# Altium schematic sheet PowerBoard_Schematic.SchDoc
size A; SheetNumber: 4; SheetTotal: 4
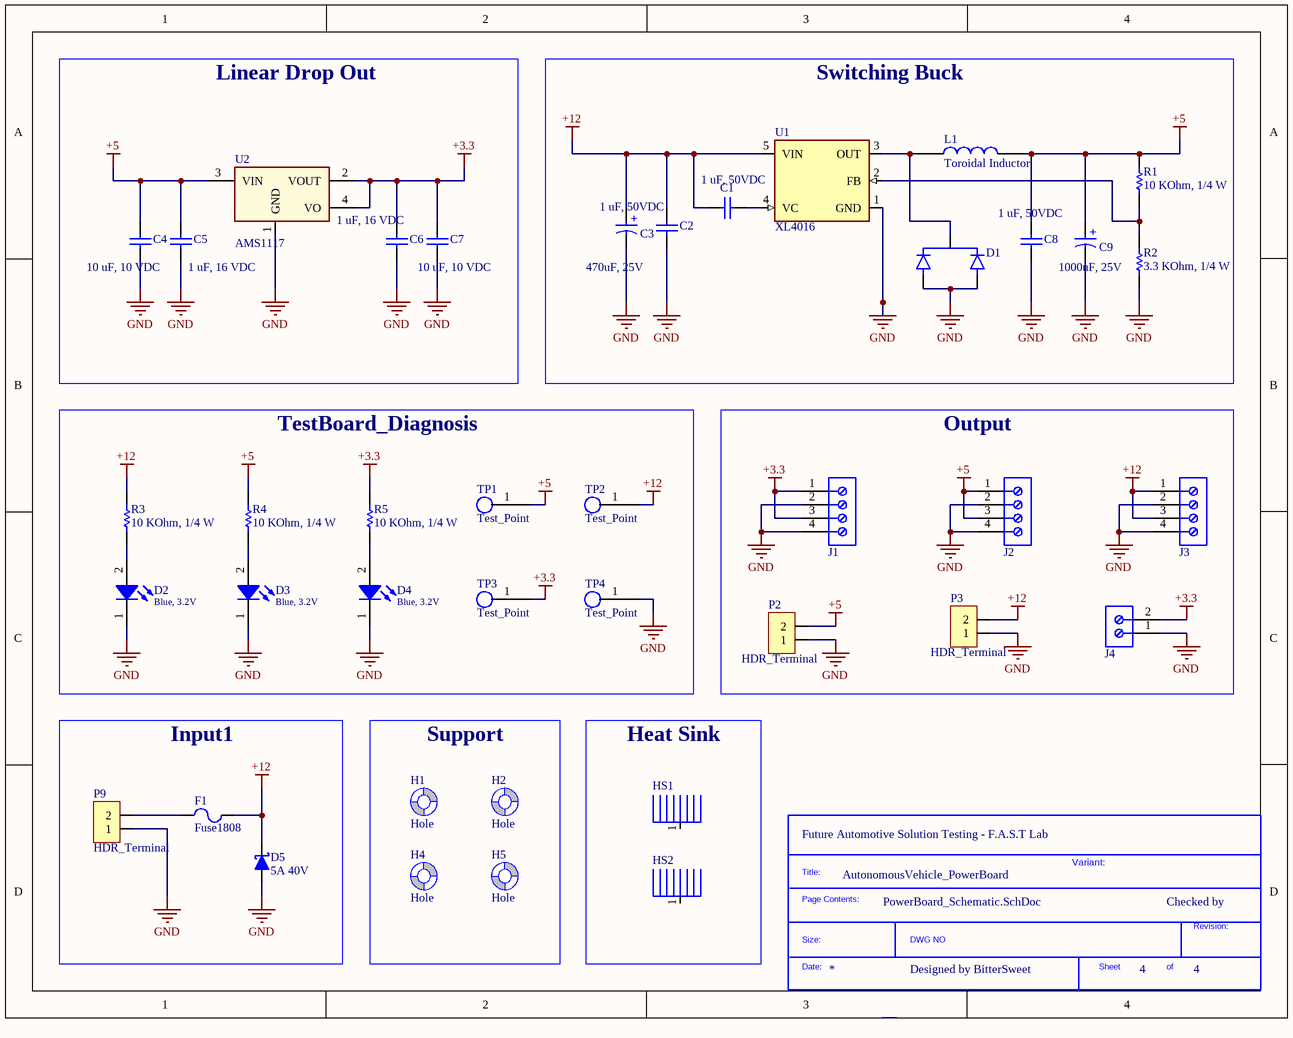
[diagram p0: PowerBoard_Schematic.SchDoc]

## Parts
*?  SDTitleBlock  (value not drawn)  (graphical)
C1  1 uF, 50VDC  [CAP_RADIAL_2.54]
C2  1 uF, 50VDC  [CAP_RADIAL_2.54]
C3  470uF, 25V  [WCAP-ASLI_D10H10.5]
C4  10 uF, 10 VDC  [CAP_0603]
C5  1 uF, 16 VDC  [CAP_0603]
C6  1 uF, 16 VDC  [CAP_0603]
C7  10 uF, 10 VDC  [CAP_0603]
C8  1 uF, 50VDC  [CAP_RADIAL_2.54]
C9  1000uF, 25V  [WCAP-ASLI_D12.5H14]
D1  Diode_Schottky  [TO-220AB]  (value not drawn)
D2  Blue, 3.2V  [WL-SMCW_0603_H=0.7mm]
D3  Blue, 3.2V  [WL-SMCW_0603_H=0.7mm]
D4  Blue, 3.2V  [WL-SMCW_0603_H=0.7mm]
D5  5A 40V  [DO-214AB, SMC]
F1  Fuse1808  [FuseHolder1808]
H1  Hole  [Hole_3.2mm]
H2  Hole  [Hole_3.2mm]
H4  Hole  [Hole_3.2mm]
H5  Hole  [Hole_3.2mm]
HS1  HeatSink_1Hole  [HEATSINK_TO220_SMALL]  (value not drawn)
HS2  HeatSink_1Hole  [HEATSINK_TO220_SMALL]  (value not drawn)
J1  6A, 150V  [691210910004]  (value not drawn)
J2  6A, 150V  [691210910004]  (value not drawn)
J3  6A, 150V  [691210910004]  (value not drawn)
J4  6A, 150V  [691210910002]  (value not drawn)
L1  Toroidal Inductor  [Toroidal Inductor]
P2  HDR_Terminal  [KF-5.08-2-R]
P3  HDR_Terminal  [KF-5.08-2-R]
P9  HDR_Terminal  [KF-5.08-2-R]
R1  10 KOhm, 1/4 W  [resistor_0603]
R2  3.3 KOhm, 1/4 W  [resistor_0603]
R3  10 KOhm, 1/4 W  [resistor_0603]
R4  10 KOhm, 1/4 W  [resistor_0603]
R5  10 KOhm, 1/4 W  [resistor_0603]
TP1  Test_Point  [TP_1_5mm_SMD]
TP2  Test_Point  [TP_1_5mm_SMD]
TP3  Test_Point  [TP_1_5mm_SMD]
TP4  Test_Point  [TP_1_5mm_SMD]
U1  XL4016  [XL4016_TO-220-5]
U2  AMS1117  [AMS1117]

## Blocks framed on the sheet
Linear Drop Out: C4-C7 U2
Switching Buck: C1-C3 C8 C9 D1 L1 R1 R2 U1
TestBoard_Diagnosis: D2-D4 R3-R5 TP1-TP4
Output: J1-J4 P2 P3
Input1: D5 F1 P9
Support: H1 H2 H4 H5
Heat Sink: HS1 HS2

## Nets
+3.3: C6.2 C7.1 J1.1 J1.3 J4.2 R5.1 TP3.1 U2.2(VOUT) U2.4(VO)
+5: C4.1 C5.2 C8.2 C9.1(P) J2.1 J2.3 L1.2 P2.2 R1.1 R4.1 TP1.1 U2.3(VIN)
+12: C1.1 C2.1 C3.1(P) D5.2(K) F1.2 J3.1 J3.3 P3.2 R3.1 TP2.1 U1.5(VIN)
GND: C2.2 C3.2(N) C4.2 C5.1 C6.1 C7.2 C8.1 C9.2(N) D1.1(A1) D1.3(A2) D2.1(K) D3.1(K) D4.1(K) D5.1(A) J1.2 J1.4 J2.2 J2.4 J3.2 J3.4 J4.1 P2.1 P3.1 P9.1 R2.1 TP4.1 U1.1(GND) U2.1(GND)
NetC1_2: C1.2 U1.4(VC)
NetD1_2: D1.2(C) L1.1 U1.3(OUT)
NetD2_2: D2.2(A) R3.2
NetD3_2: D3.2(A) R4.2
NetD4_2: D4.2(A) R5.2
NetF1_1: F1.1 P9.2
NetR1_2: R1.2 R2.2 U1.2(FB)

Not connected (* = marked no-connect by the designer): H1 1(Screw); H2 1(Screw); H4 1(Screw); H5 1(Screw); HS1 1; HS2 1

## Notes on the sheet
- (near *?) Future Automotive Solution Testing - F.A.S.T Lab
- AutonomousVehicle_PowerBoard
- Variant:
- Checked by
- Designed by BitterSweet
- (in symbol 865080457015) +
- (in symbol 865080462016) +
- (in symbol SDTitleBlock) Title:; Page Contents:; Revision:; Size:; DWG NO; Date:; Sheet; of

## Library data of the parts
C1 C2 C8 = Capacitor: JLCPCB Part: C108343; ComponentLink1Description: JLCPCB Link; ComponentLink1URL: https://jlcpcb.com/partdetail/109562-0603F105M500NT/C108343
C3 = 865080457015: V-Chip, D10 x H10.5mm, 470uF, 25V; Manufacturer: Wurth Elektronik; Capacitance Tolerance: +/-20%; Dissipation Factor: 14%; Endurance: 2000h; Leakage Current: 117.5uA; Ripple Current: 650mA; Category: Aluminum Electrolytic Capacitors; ComponentLink2Description: Datasheet Link; ComponentLink2URL: https://www.we-online.com/redexpert/spec/865080457015?ad; Mount: Surface Mount; Operating Temperature Max: 105°C; Operating Temperature Min: -55°C; Packaging: Tape and Reel; Height: 10.5mm; Diameter: 10mm; Capacitance: 470uF; Rated Voltage (DC): 25V; Supplier 1 Name: Mouser; Supplier 1 SN: 710-865080457015; Supplier 3 URL: https://www.thegioiic.com/tu-nhom-smd-470uf-25v-10x10-5mm; Supplier 3 Name: thegioiic; Supplier 1 URL: https://www.mouser.com/ProductDetail/Wurth-Elektronik/865080457015?qs=0KOYDY2FL2%252BEKTJa1jxjAQ%3D%3D; Manufacturer Part Number: N/A; Supplier 2 Name: Digi-Key; Supplier 2 SN: N/A; Supplier 2 URL: N/A; Supplier 3 SN: N/A; Value: 470uF, 25V; JLCPCB Part: *; ComponentLink3Description: JLCPCB Link; ComponentLink3URL: *
C4 C7 = 0106031061010: CAP, size 0603, 10 uF, 10 VDC; Manufacture Name: Samsung Electro-Mechanics; Manufacture SN: CL10A106KP8NNWC; Capacitance: 10 uF; Tolerance: +/-10%; Voltage Rating DC: 10 VDC; ComponentLink2Description: Datasheet; ComponentLink2URL: https://www.mouser.vn/datasheet/2/585/MLCC-1837944.pdf; Operating Temperature: -55 to +125degC; Packaging: Tape and Reel; Mounting Technology: SMT; Size: 0603; Supplier 1 Name: Mouser; Supplier 1 SN: 187-CL10A106KP8NNWC; Supplier 1 URL: https://www.mouser.vn/ProductDetail/Samsung-Electro-Mechanics/CL10A106KP8NNWC?qs=xZ%2FP%252Ba9zWqZx8LSX23YqWA%3D%3D&utm_source=mouser-refine-download&utm_medium=file&utm_campaign=CL10A106KP8NNWC&utm_content=Samsung-Electro-Mechanics; Supplier 2 Name: Digi-Key; Supplier 2 SN: 1276-CL10A106KP8NNWCTR-ND; Supplier 2 URL: https://www.digikey.com/en/products/detail/samsung-electro-mechanics/cl10a106kp8nnwc/16572907; Supplier 3 Name: thegioiic; Supplier 3 SN: N/A; Supplier 3 URL: https://www.thegioiic.com/tu-gom-0603-10uf-25v; Value: 10 uF, 10 VDC; JLCPCB Part: C91150; ComponentLink3Description: JLCPCB Link; ComponentLink3URL: https://jlcpcb.com/partdetail/92339-0603X106M100NT/C91150
C5 C6 = 0106031051016: CAP, size 0603, 1 uF, 16 VDC; Manufacture Name: Samsung Electro-Mechanics; Manufacture SN: CL10B105KO8NNWC; Capacitance: 1 uF; Tolerance: +/-10%; Voltage Rating DC: 16 VDC; ComponentLink2Description: Datasheet; ComponentLink2URL: https://www.mouser.vn/datasheet/2/585/Samsung_MLCC_1837944-1929650.pdf; Operating Temperature: -55 to +125degC; Packaging: Tape and Reel; Mounting Technology: SMT; Size: 0603; Supplier 1 Name: Mouser; Supplier 1 SN: 187-CL10B105KO8NNWC; Supplier 1 URL: https://www.mouser.vn/ProductDetail/Samsung-Electro-Mechanics/CL10B105KO8NNWC?qs=81r%252BiQLm7BT%252BXtc72qn1ug%3D%3D&utm_source=mouser-refine-download&utm_medium=file&utm_campaign=CL10B105KO8NNWC&utm_content=Samsung-Electro-Mechanics; Supplier 2 Name: Digi-Key; Supplier 2 SN: 1276-CL10B105KO8NNWCTR-ND; Supplier 2 URL: https://www.digikey.com/en/products/detail/samsung-electro-mechanics/cl10b105ko8nnwc/16572783; Supplier 3 Name: thegioiic; Supplier 3 SN: N/A; Supplier 3 URL: https://www.thegioiic.com/tu-gom-0603-1uf-16v; Value: 1 uF, 16 VDC; JLCPCB Part: C106248; ComponentLink3Description: JLCPCB Link; ComponentLink3URL: https://jlcpcb.com/partdetail/Yageo-CC0603KRX7R7BB105/C106248
C9 = 865080462016: V-Chip, D12.5 x H14mm, 1000uF, 25V; Manufacturer: Wurth Elektronik; Capacitance Tolerance: +/-20%; Dissipation Factor: 14%; Endurance: 5000h; Leakage Current: 250uA; Ripple Current: 1100mA; Category: Aluminum Electrolytic Capacitors; ComponentLink2Description: Datasheet Link; ComponentLink2URL: https://www.we-online.com/redexpert/spec/865080462016?ad; Mount: Surface Mount; Operating Temperature Max: 105°C; Operating Temperature Min: -55°C; Packaging: Tape and Reel; Height: 14mm; Diameter: 12.5mm; Capacitance: 1000uF; Rated Voltage (DC): 25V; Supplier 1 Name: Mouser; Supplier 1 SN: 710-865080462016; Supplier 1 URL: https://www.mouser.com/ProductDetail/Wurth-Elektronik/865080462016?qs=0KOYDY2FL2%252BphFKARPaJJA%3D%3D; Supplier 3 Name: thegioiic; Supplier 3 URL: https://www.thegioiic.com/tu-nhom-smd-1000uf-25v-12-5x13-5mm; Manufacturer Part Number: N/A; Supplier 2 Name: Digi-Key; Supplier 2 SN: N/A; Supplier 2 URL: N/A; Value: 1000uF, 25V; JLCPCB Part: *
D1 = Dual_Diode_Schottky: MBR20100CT Diode Schottky 100V 10A TO-220; JLCPCB Part: *
D2-D4 = 160603BlueClear: WL-SMCW SMT Mono-color Chip LED Waterclear, size 0603, Blue, 3.2V, 140deg; Type: Clear; Color: Blue; Size: 0603; ComponentLink1Description: Datasheet link; ComponentLink1URL: N/A; ComponentLink2Description: Supplier 1 URL; ComponentLink2URL: https://www.mouser.vn/ProductDetail/Wurth-Elektronik/150060BS75003?qs=Li%252BoUPsLEnu8LvIbM48DKA%3D%3D; ComponentLink3Description: Supplier 2 URL; ComponentLink3URL: https://www.digikey.com/en/products/detail/liteon/LTST-C191TBKT/388530; ComponentLink4Description: Supplier 3 URL; ComponentLink4URL: https://www.thegioiic.com/led-xanh-duong-0603-dan-smd-trong-suot; Supplier 1 Name: Mouser; Supplier 1 SN: 710-150060GS75000; Supplier 1 URL: https://www.mouser.vn/ProductDetail/Wurth-Elektronik/150060BS75003?qs=Li%252BoUPsLEnu8LvIbM48DKA%3D%3D; Supplier 2 Name: Digi-Key; Supplier 2 SN: 160-1647-2-ND; Supplier 2 URL: https://www.digikey.com/en/products/detail/liteon/LTST-C191TBKT/388530; Supplier 3 Name: ICDayRoi; Supplier 3 SN: N/A; Supplier 3 URL: https://www.thegioiic.com/led-xanh-duong-0603-dan-smd-trong-suot; Value: Blue, 3.2V; JLCPCB Part: C99290; ComponentLink5Description: JLCPCB Link; ComponentLink5URL: https://jlcpcb.com/partdetail/LiteOn-LTSTC191TBKT/C99290
D5 = Diode_Schottky: SS54 SMC Diode Schottky 5A 40V; JLCPCB Part: C2904822; ComponentLink1Description: JLCPCB Link; ComponentLink1URL: https://jlcpcb.com/partdetail/YONGYUTAI-SS54/C2904822
F1 = Fuse1808: Fuse 1808 Holder SMD fast blow L9.73xW5.03xH3.81; JLCPCB Part: C206917; ComponentLink1Description: JLCPCB Link; ComponentLink1URL: https://jlcpcb.com/partdetail/Littelfuse-0154005DRT/C206917; ComponentLink2Description: Thegioiic Link; ComponentLink2URL: https://www.thegioiic.com/de-cau-chi-1808-dan-smd; ComponentLink3Description: Fuse Thegioiic Link; ComponentLink3URL: https://www.thegioiic.com/cau-chi-cat-nhanh-smd-1808-20a-250v
J1-J3 = 691210910004: WR-TBL Series 2109 Horizontal Entry, THT, pitch 2.54mm, 4p; Manufacturer: Wurth Elektronik; Modularity: No; ComponentLink1Description: Datasheet Link; ComponentLink1URL: https://www.we-online.com/redexpert/spec/691210910004?ad; ComponentLink2Description: Supplier 1 URL; ComponentLink2URL: N/A; Manufacturer Part Number: 691210910004; Category: Terminal Blocks; Match Code: WR-TBL; Mount: Through Hole; Operating Temperature Max: 105°C; Operating Temperature Min: -40°C; Packaging: Box; Application: Rising Cage Clamp; Number of Pins: 4; Number of Rows: 1; Orientation: Horizontal; Pitch: 2.54mm; Rated Current: 6A; Working Voltage: 150V; ComponentLink3Description: Supplier 2 URL; ComponentLink3URL: N/A; ComponentLink4Description: Supplier 3 URL; ComponentLink4URL: https://www.thegioiic.com/kf120-4-v-domino-4-chan-thang-2-54mm-150v-6a-han-pcb; Supplier 1 Name: Mouser; Supplier 1 SN: N/A; Supplier 1 URL: N/A; Supplier 2 Name: Digi-Key; Supplier 2 SN: N/A; Supplier 2 URL: N/A; Supplier 3 Name: thegioiic; Supplier 3 SN: N/A; Supplier 3 URL: https://www.thegioiic.com/kf120-4-v-domino-4-chan-thang-2-54mm-150v-6a-han-pcb; Value: 6A, 150V
J4 = 691210910002: WR-TBL Series 2109 Horizontal Entry, THT, pitch 2.54mm, 2p; Manufacturer: Wurth Elektronik; Modularity: No; ComponentLink1Description: Datasheet Link; ComponentLink1URL: https://www.we-online.com/redexpert/spec/691210910002?ad; ComponentLink2Description: Supplier 1 URL; ComponentLink2URL: N/A; Manufacturer Part Number: 691210910002; Category: Terminal Blocks; Match Code: WR-TBL; Mount: Through Hole; Operating Temperature Max: 105°C; Operating Temperature Min: -40°C; Packaging: Box; Application: Rising Cage Clamp; Number of Pins: 2; Number of Rows: 1; Orientation: Horizontal; Pitch: 2.54mm; Rated Current: 6A; Working Voltage: 150V; ComponentLink3Description: Supplier 2 URL; ComponentLink3URL: N/A; ComponentLink4Description: Supplier 3 URL; ComponentLink4URL: https://www.thegioiic.com/kf128-2-v-domino-2-chan-thang-2-54mm-150v-6a-han-pcb; Supplier 1 Name: Mouser; Supplier 1 SN: N/A; Supplier 1 URL: N/A; Supplier 2 Name: Digi-Key; Supplier 2 SN: N/A; Supplier 2 URL: N/A; Supplier 3 Name: thegioiic; Supplier 3 SN: N/A; Supplier 3 URL: https://www.thegioiic.com/kf128-2-v-domino-2-chan-thang-2-54mm-150v-6a-han-pcb; Value: 6A, 150V
L1 = Toroidal Inductor: Dipole Toroidal Inductor, 47uH, 8A
P2 P3 P9 = HDR_Terminal: HDR_Terminal 2 pin; Supplier: ThegioiIC; ComponentLink1Description: URL; ComponentLink1URL: https://www.thegioiic.com/kf128-2-v-domino-2-chan-thang-3-5mm-300v-10a-han-pcb
R1 R3-R5 = 0006031031: RES, size 0603, 10 KOhm, 1/4 W; Manufacture  Name: OEM; Resistance: 10 KOhm; Rated Power: 1/4 W; Resistance Tolerance: +/-1%; Size: 0603; Mounting Technology: SMT; Supplier 1 Name: Mouser; Supplier 1 SN: 755-ESR03EZPF1002; Supplier 2 Name: Digi-Key; Supplier 2 SN: RHM10KADTR-ND RHM10KADCT-ND RHM10KADDKR-ND; Supplier 1 URL: https://www.mouser.vn/ProductDetail/ROHM-Semiconductor/ESR03EZPF1002?qs=sGAEpiMZZMvdGkrng054t67Efho1F8r6CDeAsqwFse8%3D; Supplier 3 Name: thegioiic; Supplier 3 SN: N/A; Supplier 3 URL: N/A; Manufacture  SN: OEM; Value: 10 KOhm, 1/4 W; ComponentLink1Description: Datasheet link; ComponentLink1URL: https://fscdn.rohm.com/en/products/databook/datasheet/passive/resistor/chip_resistor/esr-e.pdf; ComponentLink2Description: Supplier 1 URL; ComponentLink2URL: https://www.thegioiic.com/dien-tro-10-kohm-0603-1-; ComponentLink3Description: Supplier 2 URL; ComponentLink3URL: https://www.digikey.com/en/products/detail/rohm-semiconductor/ESR03EZPF1002/1983429; ComponentLink4Description: Supplier 3 URL; ComponentLink4URL: N/A; Supplier 2 URL: https://www.digikey.com/en/products/detail/rohm-semiconductor/ESR03EZPF1002/1983429; JLCPCB Part: C2087321; Parameter 1: *; ComponentLink5Description: JLCPCB Link; ComponentLink5URL: https://jlcpcb.com/partdetail/Yageo-RT0603BRD1010KL/C2087321
R2 = 0006033321: RES, size 0603, 3.3 KOhm, 1/4 W; Manufacture  Name: OEM; Rated Power: 1/4 W; Resistance Tolerance: +/-1%; Resistance: 3.3 KOhm; Size: 0603; Mounting Technology: SMT; Supplier 1 Name: Mouser; Supplier 1 SN: 667-ERJ-PA3F3301V; Supplier 2 Name: Digi-Key; Supplier 2 SN: 10-ERJ-UP3F3301VTR-ND 10-ERJ-UP3F3301VCT-ND 10-ERJ-UP3F3301VDKR-ND; Supplier 1 URL: https://www.mouser.vn/ProductDetail/Panasonic/ERJ-PA3F3301V?qs=sGAEpiMZZMvdGkrng054t6%2FAfIpq60YDpB2wwO%252BBqIBQy72ynM%2FI9Q%3D%3D; Supplier 3 Name: thegioiic; Supplier 3 SN: N/A; Supplier 3 URL: N/A; Manufacture  SN: OEM; Value: 3.3 KOhm, 1/4 W; ComponentLink1Description: Datasheet link; ComponentLink1URL: https://api.pim.na.industrial.panasonic.com/file_stream/main/fileversion/4484; ComponentLink2Description: Supplier 1 URL; ComponentLink2URL: N/A; ComponentLink3Description: Supplier 2 URL; ComponentLink3URL: https://www.digikey.com/en/products/detail/panasonic-electronic-components/ERJ-UP3F3301V/12093093; ComponentLink4Description: Supplier 3 URL; ComponentLink4URL: N/A; Supplier 2 URL: https://www.digikey.com/en/products/detail/panasonic-electronic-components/ERJ-UP3F3301V/12093093; JLCPCB Part: C140101; ComponentLink5Description: JLCPCB Link; ComponentLink5URL: https://jlcpcb.com/partdetail/151427-RS03L3R30FT/C140101
U1 = XL4016: IC Switching Buck 8A TO-220-5
U2 = AMS1117: IC Linear Drop Out 3.3V 1A SOT-223; JLCPCB Part: C6186; ComponentLink1Description: JLCPCB Link; ComponentLink1URL: https://jlcpcb.com/partdetail/Advanced_MonolithicSystems-AMS1117_33/C6186